# Altium schematic sheet 3_wiring drawing.SchDoc: Current sensors and IFB
size A2; ApprovedBy: Approved By; CheckedBy: Among; DrawnBy: Sky Ma; Address1: 1; Address2: 2; Address3: 3; Address4: 4; DocumentNumber: 04-TE-42-4015-0PA-A; Revision: B; SheetNumber: 4; SheetTotal: 6; SheetSize: A2; CheckedByDate: 2022-01-11; DrawByDate: 2022-11-19; SiteName: EMS TD Huangpu; ProjectName: 19205_BMW CCU DDR PCBA FT fixture wiring
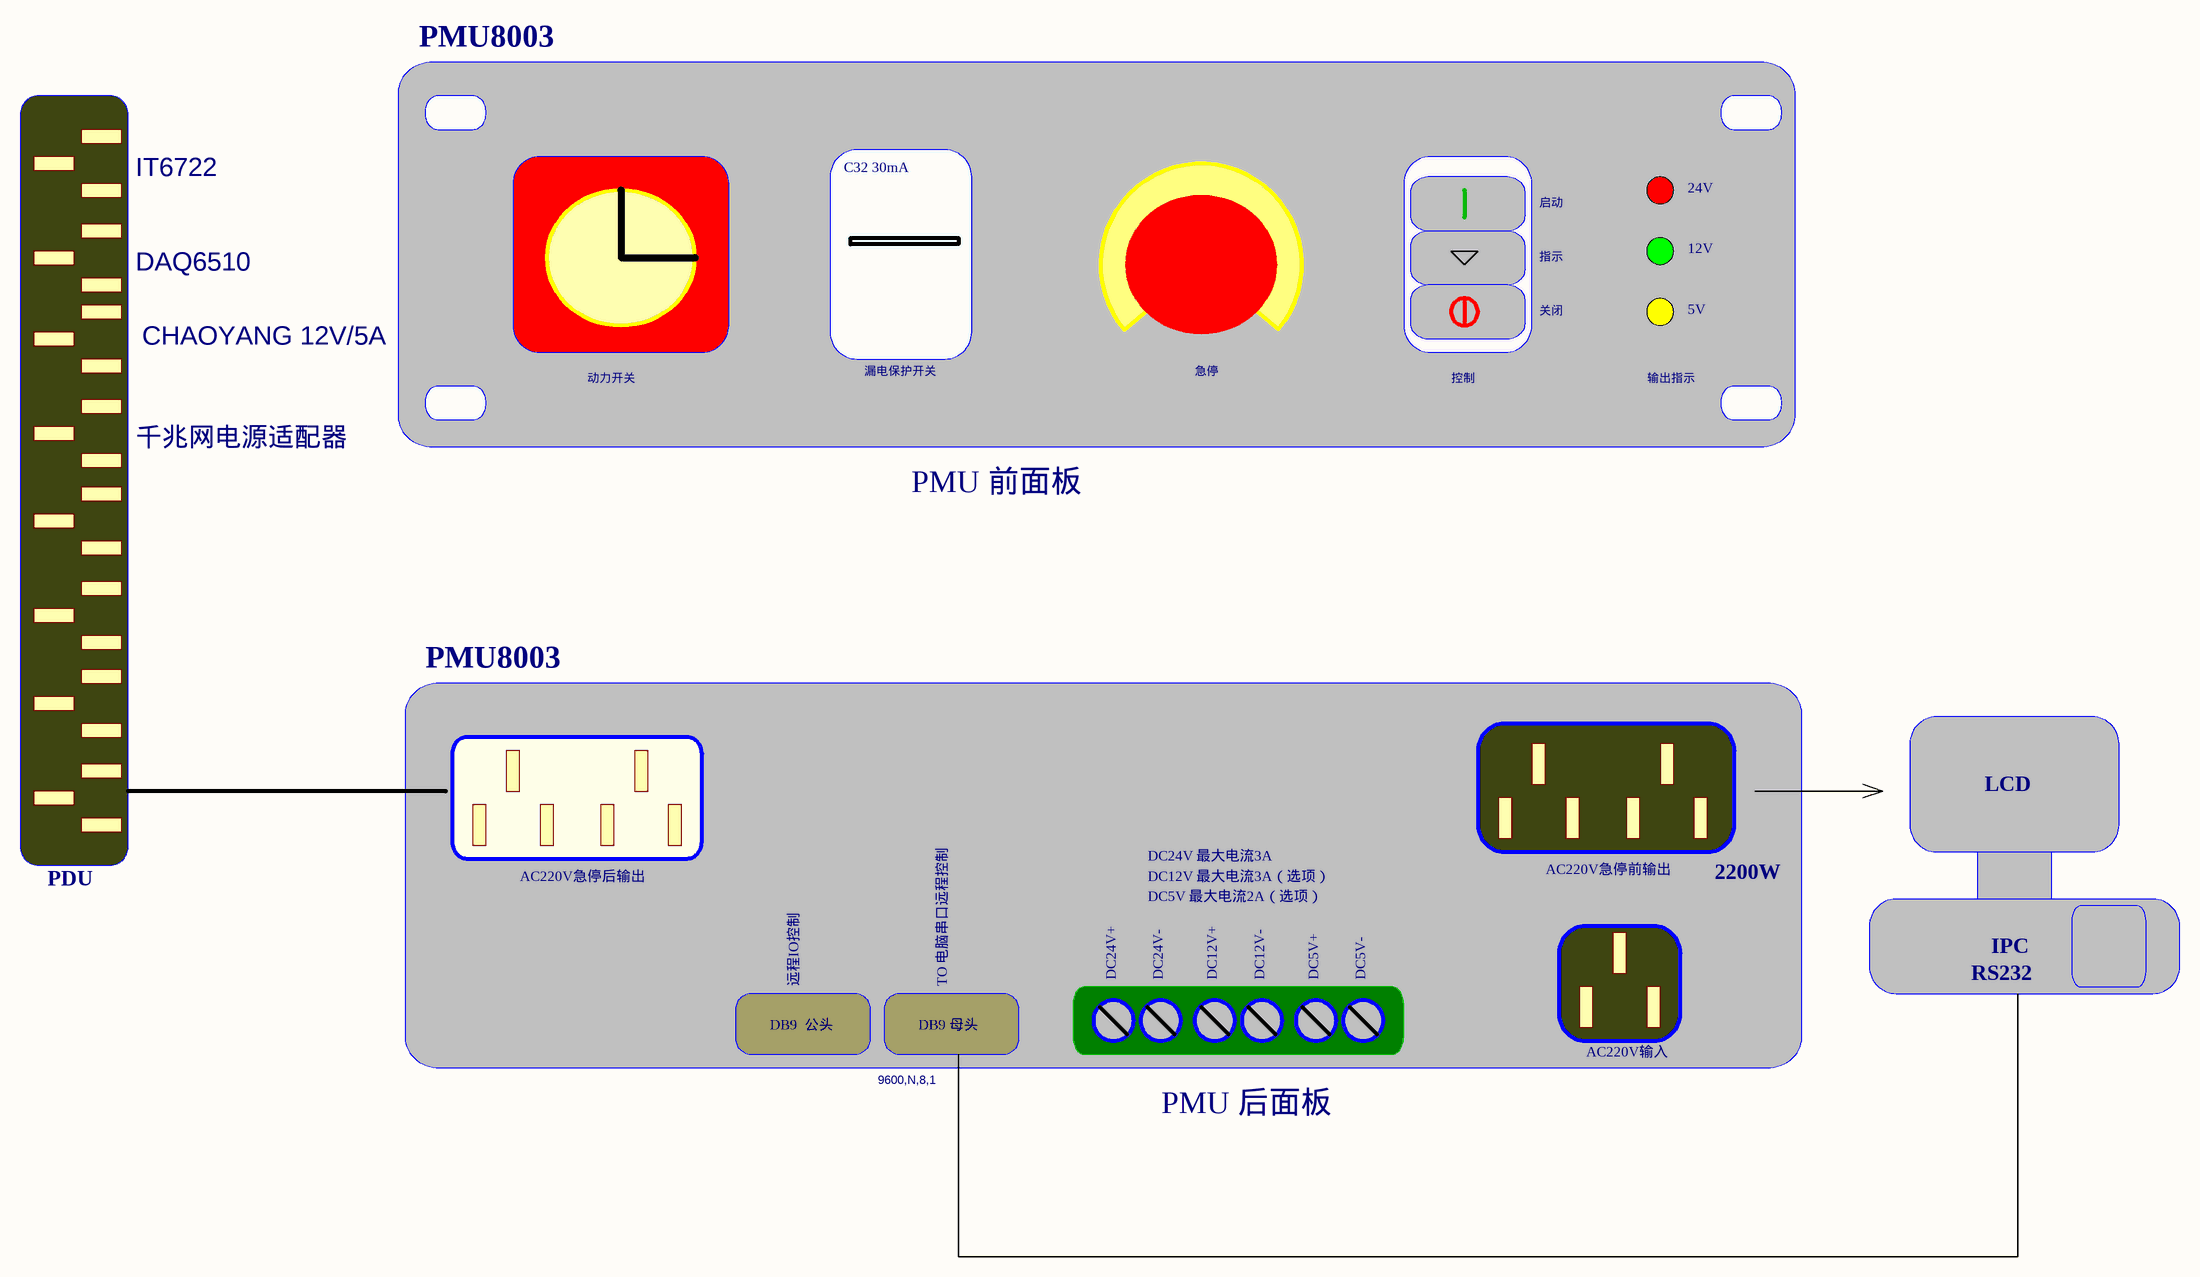
[diagram p0: 3_wiring drawing.SchDoc]

## Notes on the sheet
- PMU8003
- IT6722
- C32 30mA
- 启动
- 24V
- DAQ6510
- 指示
- 12V
- CHAOYANG 12V/5A
- 关闭
- 5V
- 动力开关
- 漏电保护开关
- 急停
- 控制
- 输出指示
- 千兆网电源适配器
- PMU 前面板
- LCD
- PDU
- AC220V急停后输出
- DC24V 最大电流3A
- DC12V 最大电流3A（选项）
- AC220V急停前输出
- 2200W
- DC5V 最大电流2A（选项）
- IPC
- DB9  公头
- 远程IO控制
- DB9 母头
- TO 电脑串口远程控制
- DC24V+
- DC24V-
- DC12V+
- DC12V-
- DC5V+
- DC5V-
- RS232
- 9600,N,8,1
- AC220V输入
- PMU 后面板
- Document Number:
- Rev:
- Project Name:
- Drawn By:
- Date:
- Titile:
- Checked By:
- Sheet:
- Of